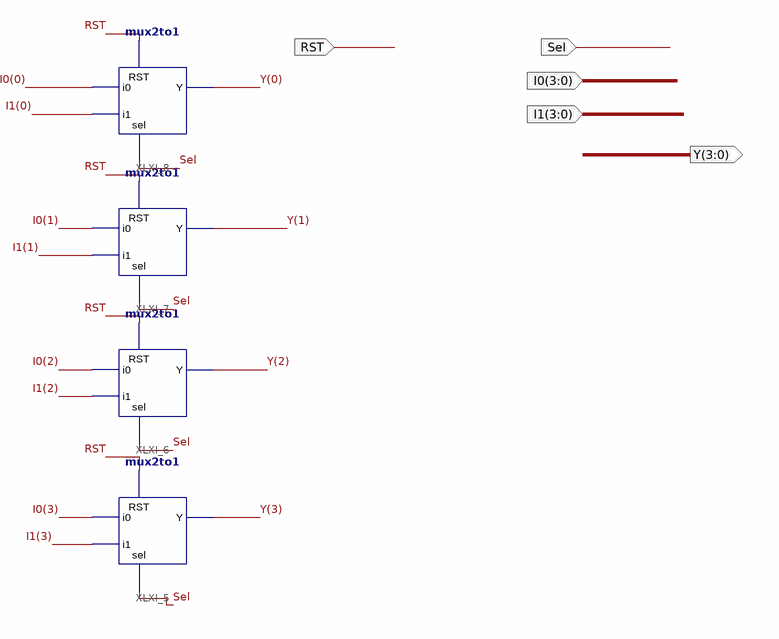
[diagram p0: schematic sheet 1]
// Xilinx ISE schematic mux2to1_4bits.sch (artix7) as structural Verilog: 4 symbols, 5 ports
module mux2to1_4bits (
  input  RST,
  input  Sel,
  input  [3:0] I0,
  input  [3:0] I1,
  output [3:0] Y
);

  mux2to1 XLXI_5 (.i0(I0[3]), .i1(I1[3]), .RST(RST), .sel(Sel), .Y(Y[3]));
  mux2to1 XLXI_6 (.i0(I0[2]), .i1(I1[2]), .RST(RST), .sel(Sel), .Y(Y[2]));
  mux2to1 XLXI_7 (.i0(I0[1]), .i1(I1[1]), .RST(RST), .sel(Sel), .Y(Y[1]));
  mux2to1 XLXI_8 (.i0(I0[0]), .i1(I1[0]), .RST(RST), .sel(Sel), .Y(Y[0]));
endmodule
